# EasyEDA schematic SCH_Decimal Display_2021-10-08.json
TITLE: Decimal Display Delectronic Scheme; REV: 1.0; Date: 2021-09-29; Sheet: 1/1; Drawn By: MarcosObel; Company: Zutup All Electronics
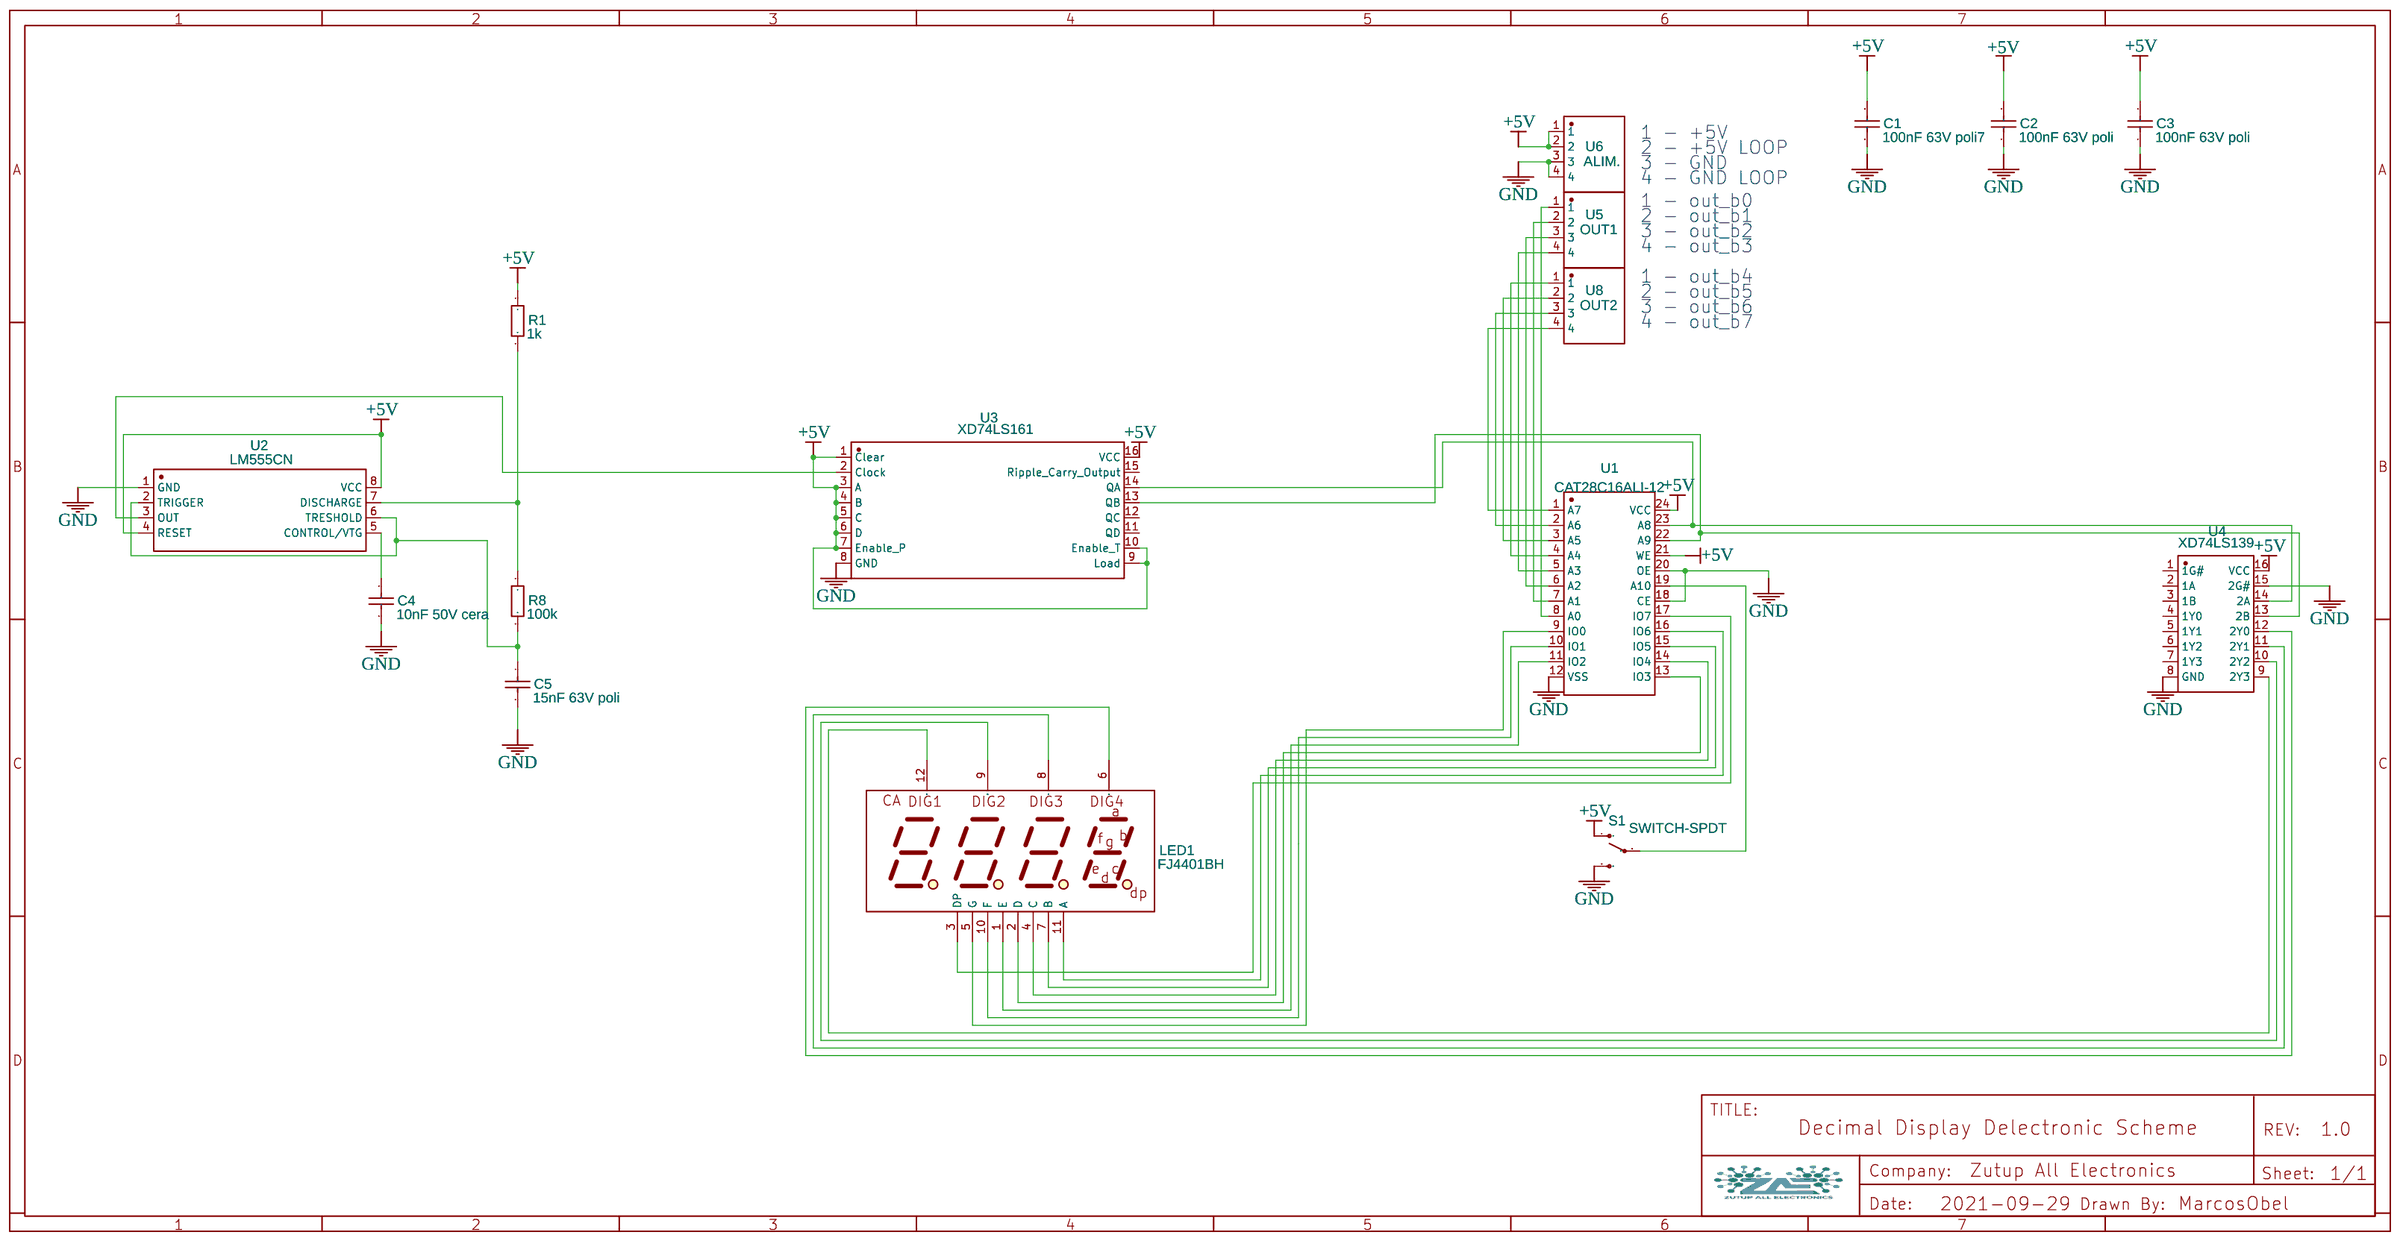
[diagram p0: schematic sheet]

## Parts
C1  100nF 63V poli7  [CAP-TH_L7.6-W3.8-P5.08-D0.51]
C2  100nF 63V poli  [CAP-TH_L7.6-W3.8-P5.08-D0.51]
C3  100nF 63V poli  [CAP-TH_L7.6-W3.8-P5.08-D0.51]
C4  10nF 50V cera  [CAP-TH_L7.6-W3.8-P5.08-D0.51]
C5  15nF 63V poli  [CAP-TH_L7.6-W3.8-P5.08-D0.51]
LED1  FJ4401BH  [LED-SEG-TH_12P-L40.4-W16.0-P2.54-S12.70-BL]
R1  1k  [RES-TH_BD3.0-L9.5-P13.50-D0.6]
R8  100k  [RES-TH_BD3.0-L9.5-P13.50-D0.6]
S1  SWITCH-SPDT  [SWITCH-SPDT-SMD]
U1  CAT28C16ALI-12  [DIP24-600]
U2  LM555CN  [DIP-8_L9.7-W6.4-P2.54-LS7.6-BL]
U3  XD74LS161  [DIP-16_L19.2-W6.6-P2.54-LS7.6-BL]
U4  XD74LS139  [DIP-16_L19.2-W6.6-P2.54-LS7.6-BL]
U5  OUT1  [HDR-TH_4P-P2.54-D1.0]
U6  ALIM.  [HDR-TH_4P-P2.54-D1.0]
U8  OUT2  [HDR-TH_4P-P2.54-D1.0]

## Library data of the parts
C1-C5 = SR305C105KAR: Supplier: LCSC; Supplier Part: C444741; Manufacturer: AVX; Contributor: LCSC; JLCPCB Part Class: Extended Part
LED1 = FJ4401BH: Supplier: LCSC; Manufacturer: ReliaPro; Supplier Part: C10712; JLCPCB Part Class: Extended Part
R1 R8 = CFR02SJ0823A10: Supplier: LCSC; Manufacturer: UniOhm; Supplier Part: C69876
S1 = SWITCH-SPDT: Contributor: SparkFun
U1 = CAT28C16ALI-12
U2 = LM555CN: Supplier: LCSC; Manufacturer: FAIRCHILD; Supplier Part: C110322
U3 = XD74LS161: Supplier: LCSC; Supplier Part: C609766; Manufacturer: XINLUDA; Contributor: LCSC; JLCPCB Part Class: Extended Part
U4 = XD74LS139: Supplier: LCSC; Supplier Part: C521175; Manufacturer: XINLUDA; Contributor: LCSC; JLCPCB Part Class: Extended Part
U5 U6 U8 = 171825-4: Supplier: LCSC; Supplier Part: C210162; Manufacturer: TE Connectivity; Contributor: LCSC; JLCPCB Part Class: Extended Part

## Nets
+5V: C1.1 C2.1 C3.1 R1.1 S1.1(O) U1.21(WE) U1.24(VCC) U2.4(RESET) U2.8(VCC) U3.1(Clear) U3.3(A) U3.4(B) U3.5(C) U3.6(D) U3.7(Enable P) U3.9(Load) U3.10(Enable T) U3.16(VCC) U4.16(VCC) U6.1 U6.2
GND: C1.2 C2.2 C3.2 C4.2 C5.2 S1.3(S) U1.12(VSS) U1.18(CE) U1.20(OE) U2.1(GND) U3.8(GND) U4.8(GND) U4.15(2G#) U6.3 U6.4
Net-(C4-1): C4.1 U2.5(CONTROL/VTG)
Net-(C5-1): C5.1 R8.2 U2.2(TRIGGER) U2.6(TRESHOLD)
Net-(LED1-1): LED1.1(E) U1.11(IO2)
Net-(LED1-2): LED1.2(D) U1.13(IO3)
Net-(LED1-3): LED1.3(DP) U1.17(IO7)
Net-(LED1-4): LED1.4(C) U1.14(IO4)
Net-(LED1-5): LED1.5(G) U1.9(IO0)
Net-(LED1-6): LED1.6(DIG4) U4.12(2Y0)
Net-(LED1-7): LED1.7(B) U1.15(IO5)
Net-(LED1-8): LED1.8(DIG3) U4.11(2Y1)
Net-(LED1-9): LED1.9(DIG2) U4.10(2Y2)
Net-(LED1-10): LED1.10(F) U1.10(IO1)
Net-(LED1-11): LED1.11(A) U1.16(IO6)
Net-(LED1-12): LED1.12(DIG1) U4.9(2Y3)
Net-(R1-2): R1.2 R8.1 U2.7(DISCHARGE)
Net-(S1-2): S1.2(P) U1.19(A10)
Net-(U1-1): U1.1(A7) U8.4
Net-(U1-2): U1.2(A6) U8.3
Net-(U1-3): U1.3(A5) U8.2
Net-(U1-4): U1.4(A4) U8.1
Net-(U1-5): U1.5(A3) U5.4
Net-(U1-6): U1.6(A2) U5.3
Net-(U1-7): U1.7(A1) U5.2
Net-(U1-8): U1.8(A0) U5.1
Net-(U1-22): U1.22(A9) U3.13(QB) U4.13(2B)
Net-(U1-23): U1.23(A8) U3.14(QA) U4.14(2A)
Net-(U2-3): U2.3(OUT) U3.2(Clock)

Not connected (* = marked no-connect by the designer): U3 11(QD) 12(QC) 15(Ripple Carry Output); U4 1(1G#) 2(1A) 3(1B) 4(1Y0) 5(1Y1) 6(1Y2) 7(1Y3)

## Notes on the sheet
- 1 - +5V
- 2 - +5V LOOP
- 3 - GND
- 4 - GND LOOP
- 1 - out_b0
- 2 - out_b1
- 3 - out_b2
- 4 - out_b3
- 1 - out_b4
- 2 - out_b5
- 3 - out_b6
- 4 - out_b7
